# Altium schematic sheet 3_Power.schdoc
size 309 x 220 mm; Symbol: Sheet-Symbol_A4; Device: Sheet-Symbol_A4; @Project Name: 2026_ALTIS_V2.0; @Page Count: 3; @Update Date: 2026-04-05; @Create Date: 2026-04-05; @Schematic Name: 2026_ALTIS; @Page No: 3; @Page Name: Power; Company: EasyEDA.com; Version: V1.0; Page Size: A4; @Create Time: 05:22:19; @Update Time: 14:22:30; @Board Name: 2026_ALTIS
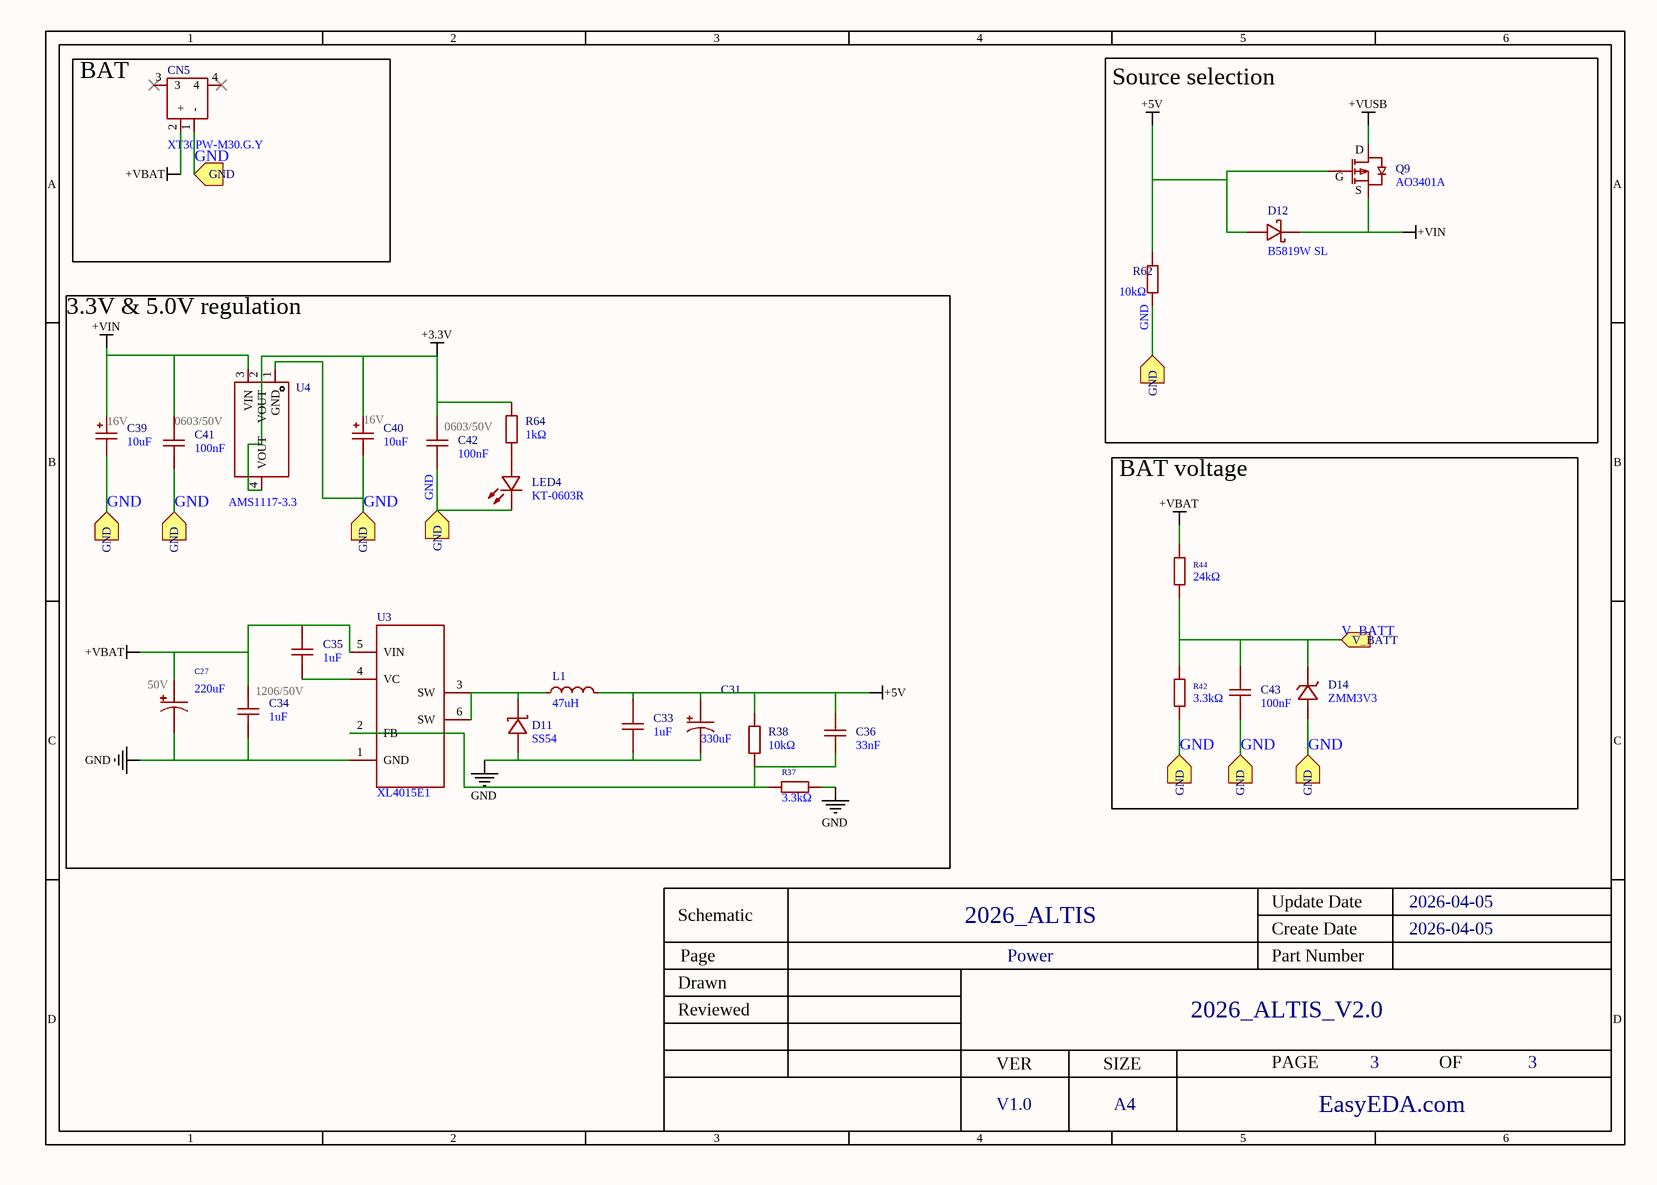
[diagram p0: 3_Power.schdoc]

## Parts
C27  220uF  [CAP-SMD_BD10.0-L10.3-W10.3-LS11.3-FD]
C31  330uF  [CAP-SMD_BD8.0-L8.3-W8.3-LS9.3-FD-1]
C33  1uF  [C1206]
C34  1uF  [C1206]
C35  1uF  [C1206]
C36  33nF  [C0805]
C39  10uF  [CAP-SMD_L3.2-W1.6-RD-C7171]
C40  10uF  [CAP-SMD_L3.2-W1.6-RD-C7171]
C41  100nF  [C0603]
C42  100nF  [C0603]
C43  100nF  [C0603]
CN5  XT30PW-M30.G.Y  [CONN-TH_XT30PW-M]
D11  SS54  [SMA_L4.4-W2.8-LS5.4-R-RD]
D12  B5819W SL  [SOD-123_L2.7-W1.6-LS3.7-RD-1]
D14  ZMM3V3  [LL-34_L3.5-W1.5-RD]
L1  47uH  [IND-SMD_L13.8-W12.8]
LED4  KT-0603R  [LED0603-RD]
Q9  AO3401A  [SOT-23_L2.9-W1.3-P1.90-LS2.4-BR]
R37  3.3kΩ  [R0805]
R38  10kΩ  [R0805]
R42  3.3kΩ  [R0603]
R44  24kΩ  [R0603]
R62  10kΩ  [R0603]
R64  1kΩ  [R0603]
U3  XL4015E1  [TO-263-5_L10.2-W8.9-P1.70-TL]
U4  AMS1117-3.3  [SOT-223-3_L6.5-W3.4-P2.30-LS7.0-BR]

## Blocks framed on the sheet
BAT: CN5
Source selection: D12 Q9 R62
3.3V & 5.0V regulation: C27 C31 C33-C36 C39-C42 D11 L1 LED4 R37 R38 R64 U3 U4
BAT voltage: C43 D14 R42 R44

## Ports
GND (in), V_BATT (in)

## Nets
+3.3V: C40.1 C42.2 R64.2 U4.2(VOUT) U4.4(VOUT)
+5V: C31.1 C33.2 C36.2 D12.2(+) L1.2 Q9.1(G) R38.2 R62.2
+VBAT: C27.1 C34.2 C35.2 CN5.2(+) R44.2 U3.5(VIN)
+VIN: C39.1 C41.2 D12.1(-) Q9.2(S) U4.3(VIN)
+VUSB: Q9.3(D)
GND: C27.2 C31.2 C33.1 C34.1 C39.2 C40.2 C41.1 C42.1 C43.1 CN5.1(-) D11.1(A) D14.2(A) LED4.1(K) R37.2 R42.1 R62.1 U3.1(GND) U4.1(GND) ; port GND
V_BATT: C43.2 D14.1(C) R42.2 R44.1 ; port V_BATT
NetC35_1: C35.1 U3.4(VC)
NetC36_1: C36.1 R37.1 R38.1 U3.2(FB)
NetD11_2: D11.2(K) L1.1 U3.3(SW) U3.6(SW)
NetLED4_2: LED4.2(A) R64.1

Not connected (* = marked no-connect by the designer): CN5 3* 4*

## Notes on the sheet
- (near Q9) G
- (near Q9) D
- (near Q9) S
- (near C39) 16V
- (near C41) 0603/50V
- (near C40) 16V
- (near C42) 0603/50V
- (near C27) 50V
- (near C34) 1206/50V
- 1
- 2
- 3
- 4
- 5
- 6
- A
- B
- C
- Schematic
- 2026_ALTIS
- Create Date
- Update Date
- 2026-04-05
- Reviewed
- Drawn
- Page
- Power
- Part Number
- 2026_ALTIS_V2.0
- VER
- SIZE
- PAGE
- OF
- V1.0
- A4
- EasyEDA.com

## Library data of the parts
C27 = UWT1H221MNL1GS: Manufacturer: Nichicon(尼吉康); Add into BOM: yes; Tolerance: ±20%; Ripple Current: 220mA@120Hz; Lifetime @ Temp: 1000hrs@105℃; Symbol: UWT1H221MNL1GS; Device: UWT1H221MNL1GS; Supplier: LCSC; Supplier Part: C125977; Manufacturer Part: UWT1H221MNL1GS; Value: 220uF; JLCPCB Part Class: Extended Part; LCSC Part Name: 220uF ±20% 50V; Supplier Footprint: SMD,D10xL10mm; Datasheet: https://atta.szlcsc.com/upload/public/pdf/source/20180326/C125982_155E7F7F009D651CD598D898348721EF.pdf; Convert to PCB: yes; Equivalent Series Resistance(ESR): -; Operating Temperature: -55℃~+105℃
C31 = RVT1E331M0810_C335985: Manufacturer: ROQANG(容强); Add into BOM: yes; Tolerance: ±20%; Voltage Rating: 25V; Ripple Current: 228mA@120Hz; Lifetime: 2000hrs@105℃; Symbol: RVT1E331M0810_C335985; Device: RVT1E331M0810_C335985; LCSC Part Name: 330uF ±20% 25V; Supplier Part: C335985; Manufacturer Part: RVT1E331M0810; Supplier Footprint: SMD,D8xL10.2mm; Supplier: LCSC; Convert to PCB: yes; Value: 330uF; Equivalent Series Resistance(ESR): -; Diameter: 8mm; Height - Seated (Max): 10.2mm; Operating Temperature: -40℃~+105℃
C33-C35 = CL31B105KBHNNNE: Manufacturer: SAMSUNG(三星); Add into BOM: yes; Tolerance: ±10%; Voltage Rating: 50V; Temperature Coefficient: X7R; Symbol: CL31B105KBHNNNE; Device: CL31B105KBHNNNE; LCSC Part Name: 1uF ±10% 50V; Supplier Part: C1848; Manufacturer Part: CL31B105KBHNNNE; Supplier Footprint: 1206; JLCPCB Part Class: Basic Part; Datasheet: https://item.szlcsc.com/datasheet/CL31B105KBHNNNE/2200.html; Supplier: LCSC; Convert to PCB: yes; Value: 1uF
C36 = 0805B333K500NT: Manufacturer: FH(风华); Add into BOM: yes; Tolerance: ±10%; Voltage Rating: 50V; Temperature Coefficient: X7R; Symbol: 0805B333K500NT; Device: 0805B333K500NT; LCSC Part Name: 33nF ±10% 50V; Supplier Part: C1739; Manufacturer Part: 0805B333K500NT; Supplier Footprint: 0805; JLCPCB Part Class: Basic Part; Datasheet: https://item.szlcsc.com/datasheet/0805B333K500NT/2091.html; Supplier: LCSC; Convert to PCB: yes; Value: 33nF
C39 C40 = TAJA106K016RNJ: Manufacturer: Kyocera AVX; Add into BOM: yes; Tolerance: ±10%; Voltage Rating: 16V; Equivalent Series Resistance(ESR): 3Ω@100kHz; Symbol: TAJA106K016RNJ; Device: TAJA106K016RNJ; LCSC Part Name: 10uF ±10% 16V; Supplier Part: C7171; Manufacturer Part: TAJA106K016RNJ; Supplier Footprint: CASE-A-3216-18(mm); Supplier: LCSC; Convert to PCB: yes; Value: 10uF; Operating Temperature: -55℃~+125℃
C41-C43 = CC0603KRX7R9BB104: Manufacturer: YAGEO(国巨); Add into BOM: yes; Tolerance: ±10%; Voltage Rating: 50V; Temperature Coefficient: X7R; Symbol: CC0603KRX7R9BB104; Device: CC0603KRX7R9BB104; LCSC Part Name: 100nF ±10% 50V; Supplier Part: C14663; Manufacturer Part: CC0603KRX7R9BB104; Supplier Footprint: 0603; Datasheet: https://item.szlcsc.com/datasheet/CC0603KRX7R9BB104/15331.html; Supplier: LCSC; Convert to PCB: yes; Value: 100nF
CN5 = XT30PW-M30.G.Y: Manufacturer: AMASS(艾迈斯); Add into BOM: yes; RatedVoltage: DC 500V; InterfaceType: Male; RatedCurrent: 15A; RecommendedWireGauge: 16/18/20AWG; contact resistance: 1.2mΩ; specifications: 2pin; Symbol: XT30PW-M; Device: XT30PW-M30.G.Y; LCSC Part Name: AMASS(艾迈斯)航模插头 卧式弯脚 XT30PW-M公头; Supplier Part: C431092; Manufacturer Part: XT30PW-M30.G.Y; Supplier Footprint: -; JLCPCB Part Class: Extended Part; Datasheet: https://item.szlcsc.com/datasheet/XT30PW-M30.G.Y/426930.html; Supplier: LCSC; Convert to PCB: yes; Power: -; Output: -; Input: -; Size: -; Interface: -; Type: Aviation model plug; Colour: -; MaximumCurrent: -; Type1: -; NumberOfUSBHoles: -; MetalMaterial: -; InsulationMaterial: -; FlameRetardantGrade: -; Belt length: -
D11 = SS54_C22452: Manufacturer: MDD(辰达半导体); Add into BOM: yes; Diode Configuration: Independent; Voltage - Forward(Vf@If): 550mV@5A; Voltage - DC Reverse(Vr): 40V; Current - Rectified: 5A; Reverse Leakage Current (Ir): 1mA@40V; Operating Junction Temperature Range: -55℃~+125℃; Symbol: SS54_C22452; Device: SS54_C22452; LCSC Part Name: 电压:40V 电流:5A; Supplier Part: C22452; Manufacturer Part: SS54; Supplier Footprint: SMA(DO-214AC); Datasheet: https://item.szlcsc.com/datasheet/SS54/23178.html; Supplier: LCSC; Convert to PCB: yes
D12 = B5819W SL: Manufacturer: CJ(江苏长电/长晶); Symbol: B5819W_C8598; Add into BOM: yes; Voltage - Forward(Vf@If): 600mV@1A; Voltage - DC Reverse(Vr): 40V; Current - Rectified: 1A; Non-Repetitive Peak Forward Surge Current: 9A; Device: B5819W SL; LCSC Part Name: 电压:40V 电流:1A; Supplier Part: C8598; Manufacturer Part: B5819W SL; Supplier Footprint: SOD-123; Datasheet: https://item.szlcsc.com/datasheet/B5819W%2520SL/9093.html; Supplier: LCSC; Convert to PCB: yes
D14 = ZMM3V3: Manufacturer: Slkor(萨科微); Symbol: ZMM3V3_C707189; Add into BOM: yes; Diode Configuration: Independent; Zener Voltage(Nom): 3.3V; Reverse Leakage Current (Ir): 2uA; Zener Voltage(Range): 3.1V~3.5V; Pd - Power Dissipation: 500mW; Impedance(Zzt): 85Ω; Impedance(Zzk): 600Ω; Device: ZMM3V3; LCSC Part Name: 独立式 耐压:3.3V 电流:2uA; Supplier Part: C707189; Manufacturer Part: ZMM3V3; Supplier Footprint: LL-34; JLCPCB Part Class: Extended Part; Datasheet: https://item.szlcsc.com/datasheet/ZMM3V3/744311.html; Supplier: LCSC; Convert to PCB: yes
L1 = CYA1265-47UH: Manufacturer: SHOU HAN(首韩); Add into BOM: yes; Tolerance: ±20%; Saturation Current (Isat): 11A; DC Resistance (DCR): 98Ω; Type: Integrated molded inductor; Symbol: CYA1265-47UH; Device: CYA1265-47UH; LCSC Part Name: 47uH ±20% 11A; Supplier Part: C19268672; Manufacturer Part: CYA1265-47UH; Supplier Footprint: SMD,13.8x12.8mm; JLCPCB Part Class: Extended Part; Datasheet: https://atta.szlcsc.com/upload/public/pdf/source/20231127/0351BCF50C14F2A3991722123A928B05.pdf; Supplier: LCSC; Convert to PCB: yes; Value: 47uH
LED4 = KT-0603R: Manufacturer: KENTO; Add into BOM: yes; Emitted Color: Red; Symbol: KT-0603R; Device: KT-0603R; LCSC Part Name: 0603 红灯 高亮; Supplier Part: C2286; Manufacturer Part: KT-0603R; Supplier Footprint: 0603; JLCPCB Part Class: Basic Part; Datasheet: https://atta.szlcsc.com/upload/public/pdf/source/20160616/1466072038404.pdf; Supplier: LCSC; Convert to PCB: yes; Power Dissipation: -; Forward Current: -; Dominant Wavelength: -; Peak Wavelength: -; Diode Configuration: -; Lens Color: -; Color Temperature: -; Viewing Angle: -; Mounting Sytle: -; Operating Temperature: -40℃~+85℃
Q9 = AO3401A_C15127: Manufacturer: AOS; Add into BOM: yes; Number: 1 P-Channel; Drain to Source Voltage: 30V; Current - Continuous Drain(Id): 4A; RDS(on): 47mΩ@10V；85mΩ@2.5V；60mΩ@4.5V; Gate Threshold Voltage (Vgs(th)): 900mV@250uA; Gate Charge(Qg): 14nC@10V; Input Capacitance(Ciss): 645pF; Reverse Transfer Capacitance (Crss@Vds): 55pF; Output Capacitance(Coss): 80pF; Symbol: AO3401A; Device: AO3401A_C15127; LCSC Part Name: 1个P沟道 耐压:30V 电流:4A; Supplier Part: C15127; Manufacturer Part: AO3401A; Supplier Footprint: SOT-23; Datasheet: https://item.szlcsc.com/datasheet/AO3401A/15801.html; Supplier: LCSC; Convert to PCB: yes; Pd - Power Dissipation: -; Operating Temperature: -; Type: -
R37 = 0805W8F3301T5E: Manufacturer: UNI-ROYAL(厚声); Add into BOM: yes; Tolerance: ±1%; Power(Watts): 125mW; Voltage-Supply(Max): 150V; Temperature Coefficient: ±100ppm/℃; Symbol: 0805W8F3301T5E; Device: 0805W8F3301T5E; Supplier: LCSC; Manufacturer Part: 0805W8F3301T5E; Supplier Part: C26010; Value: 3.3kΩ; LCSC Part Name: 3.3kΩ ±1% 125mW 厚膜电阻; Supplier Footprint: 0805; Datasheet: https://item.szlcsc.com/datasheet/0805W8F3301T5E/26753.html; Convert to PCB: yes; Type: Thick Film Resistor; Operating Temperature: -55℃~+155℃
R38 = 0805W8F1002T5E: Manufacturer: UNI-ROYAL(厚声); Add into BOM: yes; Tolerance: ±1%; Power(Watts): 125mW; Voltage-Supply(Max): 150V; Temperature Coefficient: ±100ppm/℃; Symbol: 0805W8F1002T5E; Device: 0805W8F1002T5E; LCSC Part Name: 10kΩ ±1% 125mW 厚膜电阻; Supplier Part: C17414; Manufacturer Part: 0805W8F1002T5E; Supplier Footprint: 0805; JLCPCB Part Class: Basic Part; Datasheet: https://item.szlcsc.com/datasheet/0805W8F1002T5E/18102.html; Supplier: LCSC; Convert to PCB: yes; Type: Thick Film Resistor; Value: 10kΩ; Operating Temperature: -55℃~+155℃
R42 = 0603WAF3301T5E: Manufacturer: UNI-ROYAL(厚声); Add into BOM: yes; Tolerance: ±1%; Power(Watts): 100mW; Voltage-Supply(Max): 75V; Temperature Coefficient: ±100ppm/℃; Symbol: 0603WAF3301T5E; Device: 0603WAF3301T5E; Supplier: LCSC; Manufacturer Part: 0603WAF3301T5E; Supplier Part: C22978; Value: 3.3kΩ; LCSC Part Name: 3.3kΩ ±1% 100mW 厚膜电阻; Supplier Footprint: 0603; Datasheet: https://item.szlcsc.com/datasheet/0603WAF3301T5E/23705.html; Convert to PCB: yes; Type: Thick Film Resistor; Operating Temperature: -55℃~+155℃
R44 = 0603WAF2402T5E: Manufacturer: UNI-ROYAL(厚声); Add into BOM: yes; Tolerance: ±1%; Power(Watts): 100mW; Voltage-Supply(Max): 75V; Temperature Coefficient: ±100ppm/℃; Symbol: 0603WAF2402T5E; Device: 0603WAF2402T5E; Supplier: LCSC; Manufacturer Part: 0603WAF2402T5E; Supplier Part: C23352; Value: 24kΩ; JLCPCB Part Class: Basic Part; LCSC Part Name: 24kΩ ±1% 100mW 厚膜电阻; Supplier Footprint: 0603; Datasheet: https://item.szlcsc.com/datasheet/0603WAF2402T5E/24085.html; Convert to PCB: yes; Type: Thick Film Resistor; Operating Temperature: -55℃~+155℃
R62 = 0603WAF1002T5E: Manufacturer: UNI-ROYAL(厚声); Add into BOM: yes; Tolerance: ±1%; Power(Watts): 100mW; Voltage-Supply(Max): 75V; Temperature Coefficient: ±100ppm/℃; Symbol: 0603WAF1002T5E; Device: 0603WAF1002T5E; LCSC Part Name: 厚膜电阻 10kΩ ±1% 100mW; Supplier Part: C25804; Manufacturer Part: 0603WAF1002T5E; Supplier Footprint: 0603; JLCPCB Part Class: Basic Part; Datasheet: https://item.szlcsc.com/datasheet/0603WAF1002T5E/26547.html; Supplier: LCSC; Convert to PCB: yes; Type: Thick Film Resistor; Value: 10kΩ; Operating Temperature: -55℃~+155℃
R64 = 0603WAF1001T5E: Manufacturer: UNI-ROYAL(厚声); Add into BOM: yes; Tolerance: ±1%; Power(Watts): 100mW; Voltage-Supply(Max): 75V; Temperature Coefficient: ±100ppm/℃; Symbol: 0603WAF1001T5E; Device: 0603WAF1001T5E; LCSC Part Name: 1kΩ ±1% 100mW 厚膜电阻; Supplier Part: C21190; Manufacturer Part: 0603WAF1001T5E; Supplier Footprint: 0603; JLCPCB Part Class: Basic Part; Datasheet: https://item.szlcsc.com/datasheet/0603WAF1001T5E/21904.html; Supplier: LCSC; Convert to PCB: yes; Type: Thick Film Resistor; Value: 1kΩ; Operating Temperature: -55℃~+155℃
U3 = XL4015E1: Manufacturer: XLSEMI(芯龙); Add into BOM: yes; Function: Buck; Voltage - Supply: 8V~36V; Output Voltage: 1.25V~32V; Output Current: 5A; Frequency - Switching: 180kHz; Synchronous Rectifier: No; Number of Outputs: 1; Quiescent Current: 5mA; Switch tube (built-in/external): Built-in; Output Type: Adjustable; Symbol: XL4015E1; Device: XL4015E1; LCSC Part Name: 5A 180KHz 36V 降压型DC-DC转换器; Supplier Part: C51661; Manufacturer Part: XL4015E1; Supplier Footprint: TO-263-5; JLCPCB Part Class: Extended Part; Datasheet: https://item.szlcsc.com/datasheet/XL4015E1/52674.html; Supplier: LCSC; Convert to PCB: yes; Operating Temperature: -40℃~+125℃; Topology: Buck
U4 = AMS1117-3.3_C6186: Manufacturer: AMS; Add into BOM: yes; Output Type: Fixed; Voltage - Supply: 16V; Output Voltage: 3.3V; Output Current: 1A; Power Supply Rejection Ratio (PSRR): 72dB@(120Hz); Voltage Dropout: 1.1V@(800mA); standby current: 5mA; Noise: 0.003%Vout; Output Configuration: Positive; Number of Outputs: 1; Symbol: AMS1117-3.3; Device: AMS1117-3.3_C6186; LCSC Part Name: 输出3.3V 1A; Supplier Part: C6186; Manufacturer Part: AMS1117-3.3; Supplier Footprint: SOT-223; Datasheet: https://item.szlcsc.com/datasheet/AMS1117-3.3/6652.html; Supplier: LCSC; Convert to PCB: yes; Features: Over Current Protection；Over Temperature Protection; Operating Temperature: -40℃~+125℃